# Altium schematic sheet EFM32_clock.SchDoc
size A4
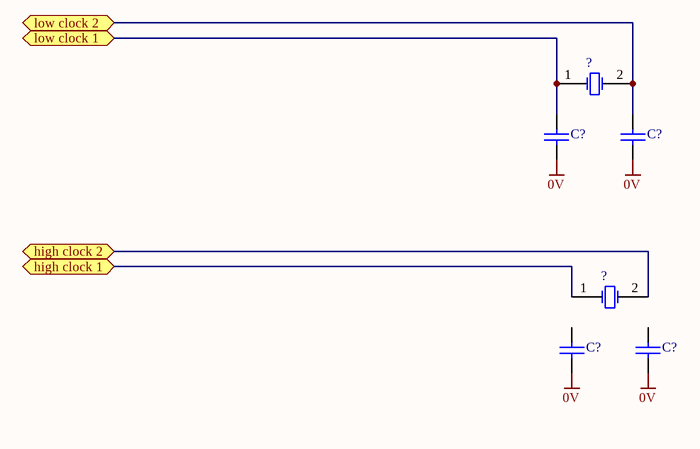
[diagram p0: EFM32_clock.SchDoc]

## Parts
(Parts that share a designator on the sheet are numbered #1, #2 ... from top to bottom, then left to right.)
?#1  XTAL  [R38]  (value not drawn)
?#2  XTAL  [R38]  (value not drawn)
C?#1  Cap  [RAD-0.3]  (value not drawn)
C?#2  Cap  [RAD-0.3]  (value not drawn)
C?#3  Cap  [RAD-0.3]  (value not drawn)
C?#4  Cap  [RAD-0.3]  (value not drawn)

## Ports
high clock 1, high clock 2, low clock 1, low clock 2

## Nets
0V: C?#1.1 C?#2.1 C?#3.1 C?#4.1
high clock 1: ?#2.1(OSC1) ; port high clock 1
high clock 2: ?#2.2(OSC2) ; port high clock 2
low clock 1: ?#1.1(OSC1) C?#1.2 ; port low clock 1
low clock 2: ?#1.2(OSC2) C?#2.2 ; port low clock 2

Not connected (* = marked no-connect by the designer): C?#3 2; C?#4 2

## Library data of the parts
?#1 ?#2 = XTAL: Crystal Oscillator; Published: 8-Jun-2000; LatestRevisionDate: 17-Jul-2002; LatestRevisionNote: Re-released for DXP Platform.; PackageReference: R38; Publisher: Altium Limited; PackageDescription: Crystal, Thru-Hole; 2 Leads; Body 3.1 x 8.2 mm (Dia.xH)
C?#1-C?#4 = Cap: Capacitor; Value: 100pF; Published: 8-Jun-2000; LatestRevisionDate: 17-Jul-2002; LatestRevisionNote: Re-released for DXP Platform.; PackageReference: RAD-0.3; Publisher: Altium Limited; PackageDescription: Radial Cap, Thru-Hole; 2 Leads; 0.3 in Pin Spacing